# EAGLE design PFC_v1 (EAGLE 7.6.0)
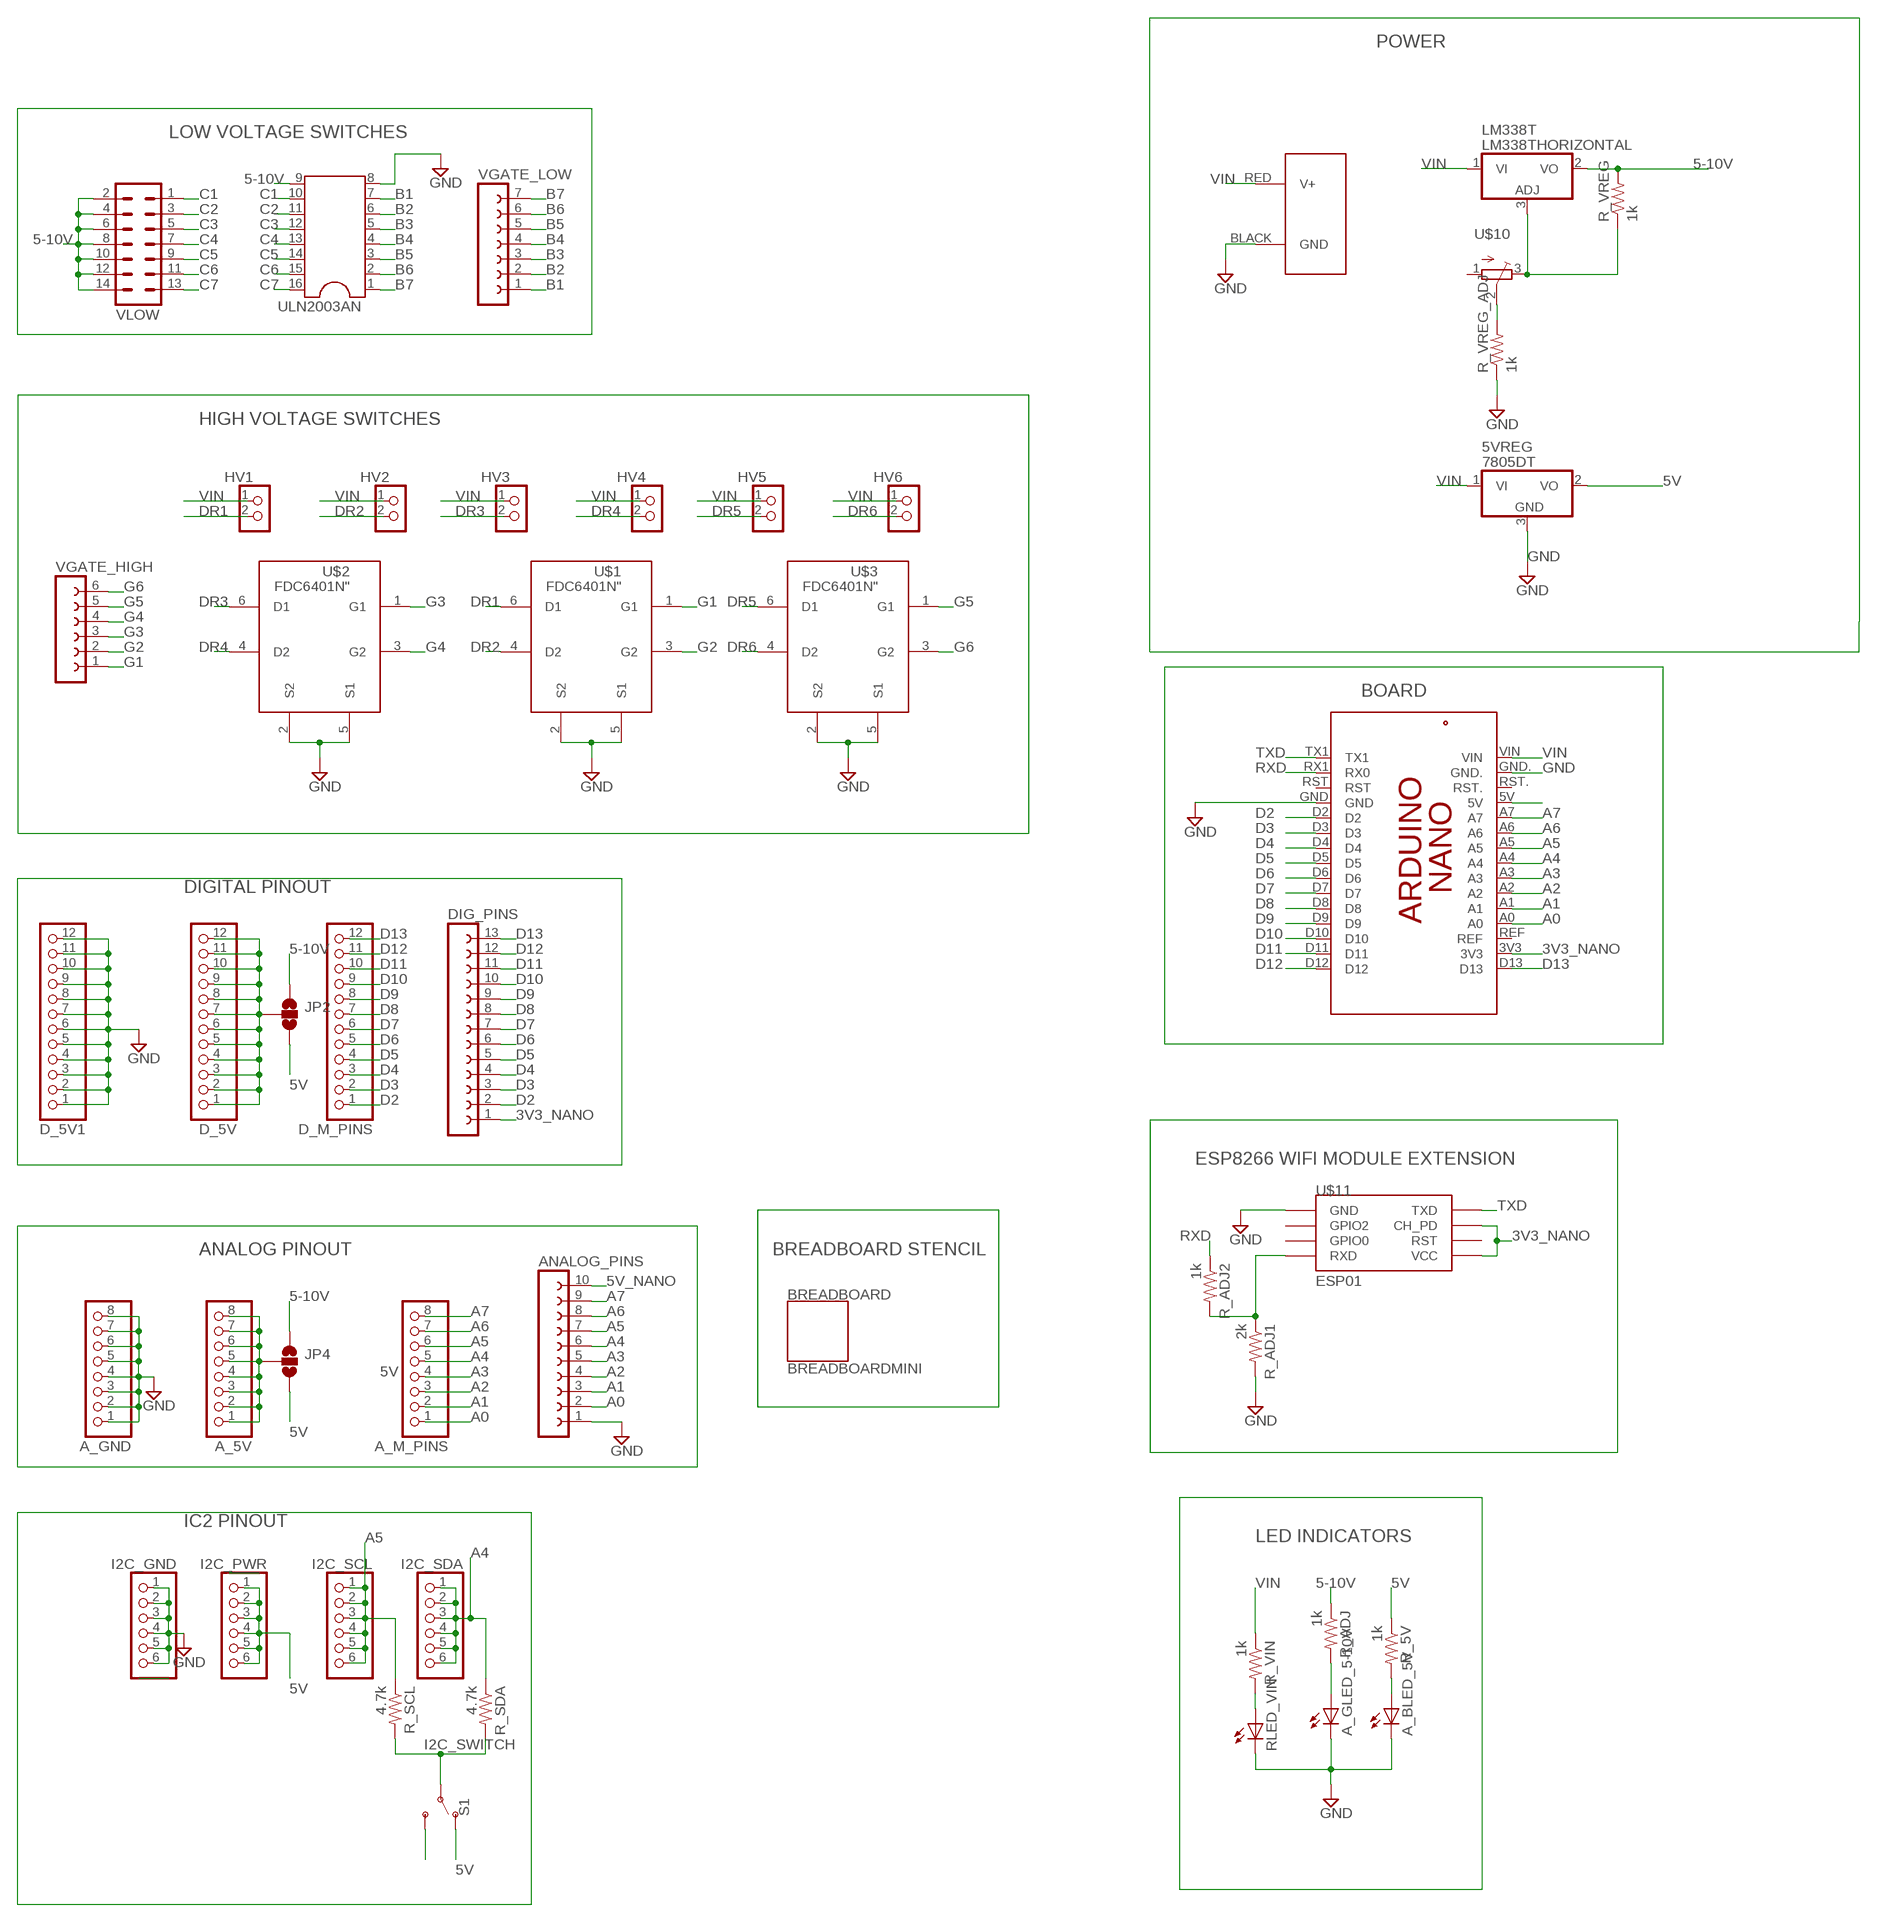
[diagram p0: schematic, sheet 1]

## Parts
5VREG  7805DT  [TO252]
A_5V  PINHD-1X8CLEANBIG  [1X08-CLEANBIG]
A_BLED_5V  LEDCHIP-LED0603  [CHIP-LED0603]
A_GLED_5-10V  LEDCHIP-LED0603  [CHIP-LED0603]
A_GND  PINHD-1X8CLEANBIG  [1X08-CLEANBIG]
A_M_PINS  PINHD-1X8CLEANBIG  [1X08-CLEANBIG]
ANALOG_PINS  FE10-1  [FE10]
BREADBOARD  BREADBOARDMINI  [BREADBOARD-MINI]
D_5V  PINHD-1X12-CB  [1X12-CB]
D_5V1  PINHD-1X12-CB  [1X12-CB]
D_M_PINS  PINHD-1X12-CB  [1X12-CB]
DIG_PINS  FE13-1  [FE13]
HV1  PINHD-2X1  [2X01]
HV2  PINHD-2X1  [2X01]
HV3  PINHD-2X1  [2X01]
HV4  PINHD-2X1  [2X01]
HV5  PINHD-2X1  [2X01]
HV6  PINHD-2X1  [2X01]
I2C_GND  PINHD-1X6CLEAN  [1X06-CLEAN]
I2C_PWR  PINHD-1X6CLEAN  [1X06-CLEAN]
I2C_SCL  PINHD-1X6CLEAN  [1X06-CLEAN]
I2C_SDA  PINHD-1X6CLEAN  [1X06-CLEAN]
J1  POWERPOLE_POWER25A_HORIZONTAL_G2  [POWERPOLE_PAIR_25A_HORIZ_G2]
JP2  SOLDERJUMPER_2WAYT  [SJ_2]
JP4  SOLDERJUMPER_2WAYT  [SJ_2]
LM338T  LM338THORIZONTAL  [TO220H]
PCB1  ARDUINO_NANO_SHIELD  [ARDUINO_NANO_SHIELD]
R_5V  1k  R-US_R0603  [R0603]
R_ADJ  1k  R-US_R0603  [R0603]
R_ADJ1  2k  R-US_R0603  [R0603]
R_ADJ2  1k  R-US_R0603  [R0603]
R_SCL  4.7k  R-US_R0603  [R0603]
R_SDA  4.7k  R-US_R0603  [R0603]
R_VIN  1k  R-US_R0603  [R0603]
R_VREG  1k  R-US_R0603  [R0603]
R_VREG_ADJ  1k  R-US_R0603  [R0603]
RLED_VIN  LEDCHIP-LED0603  [CHIP-LED0603]
S1  SWITCH-SPDT-PTH-11.6X4.0MM  [SWITCH_SPDT_PTH_11.6X4.0MM]
U$1  FDC6401N"  [SSOT-6]
U$2  FDC6401N"  [SSOT-6]
U$3  FDC6401N"  [SSOT-6]
U$10  TRIMPOTTC33X  [TC33X]
U$11  ESP01  [ESP01]
ULN2003AN  DIL16S  [SOCKET-16]
VGATE_HIGH  FE06-1  [FE06]
VGATE_LOW  FE07-1  [FE07]
VLOW  MA07-2  [MA07-2]

## Nets
3V3_NANO: DIG_PINS.1 PCB1.3V3 U$11.CH_PD U$11.VCC
5-10V: JP2.1 JP4.1 LM338T.2(VO) R_ADJ.1 R_VREG.2 ULN2003AN.9 VLOW.2 VLOW.4 VLOW.6 VLOW.8 VLOW.10 VLOW.12 VLOW.14
5V: 5VREG.2(VO) I2C_PWR.1 I2C_PWR.2 I2C_PWR.3 I2C_PWR.4 I2C_PWR.5 I2C_PWR.6 JP2.3 JP4.3 R_5V.1 S1.1(O)
5V_NANO: ANALOG_PINS.10 PCB1.5V
A0: A_M_PINS.1 ANALOG_PINS.2 PCB1.A0
A1: A_M_PINS.2 ANALOG_PINS.3 PCB1.A1
A2: A_M_PINS.3 ANALOG_PINS.4 PCB1.A2
A3: A_M_PINS.4 ANALOG_PINS.5 PCB1.A3
A4: A_M_PINS.5 ANALOG_PINS.6 I2C_SDA.1 I2C_SDA.2 I2C_SDA.3 I2C_SDA.4 I2C_SDA.5 I2C_SDA.6 PCB1.A4 R_SDA.1
A5: A_M_PINS.6 ANALOG_PINS.7 I2C_SCL.1 I2C_SCL.2 I2C_SCL.3 I2C_SCL.4 I2C_SCL.5 I2C_SCL.6 PCB1.A5 R_SCL.1
A6: A_M_PINS.7 ANALOG_PINS.8 PCB1.A6
A7: A_M_PINS.8 ANALOG_PINS.9 PCB1.A7
B1: ULN2003AN.7 VGATE_LOW.1
B2: ULN2003AN.6 VGATE_LOW.2
B3: ULN2003AN.5 VGATE_LOW.3
B4: ULN2003AN.4 VGATE_LOW.4
B5: ULN2003AN.3 VGATE_LOW.5
B6: ULN2003AN.2 VGATE_LOW.6
B7: ULN2003AN.1 VGATE_LOW.7
C1: ULN2003AN.10 VLOW.1
C2: ULN2003AN.11 VLOW.3
C3: ULN2003AN.12 VLOW.5
C4: ULN2003AN.13 VLOW.7
C5: ULN2003AN.14 VLOW.9
C6: ULN2003AN.15 VLOW.11
C7: ULN2003AN.16 VLOW.13
D2: D_M_PINS.1 DIG_PINS.2 PCB1.D2
D3: D_M_PINS.2 DIG_PINS.3 PCB1.D3
D4: D_M_PINS.3 DIG_PINS.4 PCB1.D4
D5: D_M_PINS.4 DIG_PINS.5 PCB1.D5
D6: D_M_PINS.5 DIG_PINS.6 PCB1.D6
D7: D_M_PINS.6 DIG_PINS.7 PCB1.D7
D8: D_M_PINS.7 DIG_PINS.8 PCB1.D8
D9: D_M_PINS.8 DIG_PINS.9 PCB1.D9
D10: D_M_PINS.9 DIG_PINS.10 PCB1.D10
D11: D_M_PINS.10 DIG_PINS.11 PCB1.D11
D12: D_M_PINS.11 DIG_PINS.12 PCB1.D12
D13: D_M_PINS.12 DIG_PINS.13 PCB1.D13
DR1: HV1.2 U$1.6(D1)
DR2: HV2.2 U$1.4(D2)
DR3: HV3.2 U$2.6(D1)
DR4: HV4.2 U$2.4(D2)
DR5: HV5.2 U$3.6(D1)
DR6: HV6.2 U$3.4(D2)
G1: U$1.1(G1) VGATE_HIGH.1
G2: U$1.3(G2) VGATE_HIGH.2
G3: U$2.1(G1) VGATE_HIGH.3
G4: U$2.3(G2) VGATE_HIGH.4
G5: U$3.1(G1) VGATE_HIGH.5
G6: U$3.3(G2) VGATE_HIGH.6
GND: 5VREG.3(GND) A_BLED_5V.C A_GLED_5-10V.C A_GND.1 A_GND.2 A_GND.3 A_GND.4 A_GND.5 A_GND.6 A_GND.7 A_GND.8 ANALOG_PINS.1 D_5V1.1 D_5V1.2 D_5V1.3 D_5V1.4 D_5V1.5 D_5V1.6 D_5V1.7 D_5V1.8 D_5V1.9 D_5V1.10 D_5V1.11 D_5V1.12 I2C_GND.1 I2C_GND.2 I2C_GND.3 I2C_GND.4 I2C_GND.5 I2C_GND.6 J1.BLACK(GND) PCB1.GND PCB1.GND. R_ADJ1.2 R_VREG_ADJ.1 RLED_VIN.C U$1.2(S2) U$1.5(S1) U$2.2(S2) U$2.5(S1) U$3.2(S2) U$3.5(S1) U$11.GND ULN2003AN.8
I2C_SWITCH: R_SCL.2 R_SDA.2 S1.2(P)
N$1: R_VIN.2 RLED_VIN.A
N$2: R_VREG_ADJ.2 U$10.2(S)
N$3: A_GLED_5-10V.A R_ADJ.2
N$4: A_BLED_5V.A R_5V.2
N$5: LM338T.3(GND) R_VREG.1 U$10.3(E)
N$6: D_5V.1 D_5V.2 D_5V.3 D_5V.4 D_5V.5 D_5V.6 D_5V.7 D_5V.8 D_5V.9 D_5V.10 D_5V.11 D_5V.12 JP2.2
N$8: A_5V.1 A_5V.2 A_5V.3 A_5V.4 A_5V.5 A_5V.6 A_5V.7 A_5V.8 JP4.2
N$15: S1.3(S)
RXD: PCB1.RX1(RX0) R_ADJ1.1 R_ADJ2.1 R_ADJ2.2 U$11.RX(RXD)
TXD: PCB1.TX1 U$11.TX(TXD)
VIN: 5VREG.1(VI) HV1.1 HV2.1 HV3.1 HV4.1 HV5.1 HV6.1 J1.RED(V+) LM338T.1(VI) PCB1.VIN R_VIN.1
Unconnected: PCB1.REF PCB1.RST PCB1.RST. U$10.1(A) U$11.GPIO0 U$11.GPIO2 U$11.RST

## Notes on the sheet
- POWER
- LOW VOLTAGE SWITCHES
- HIGH VOLTAGE SWITCHES
- BOARD
- DIGITAL PINOUT
- ESP8266 WIFI MODULE EXTENSION
- ANALOG PINOUT | BREADBOARD STENCIL
- IC2 PINOUT
- LED INDICATORS

## Library data of the parts
5VREG = adafruit:78*: Positive VOLTAGE REGULATOR Added bigger pads to the TO-92 package
A_5V A_GND A_M_PINS = adafruit:PINHD-1X8: PIN HEADER
A_BLED_5V A_GLED_5-10V RLED_VIN = led:LED: LED OSRAM: - CHIPLED LG R971, LG N971, LY N971, LG Q971, LY Q971, LO R971, LY R971 LH N974, LH R974 LS Q976, LO Q976, LY Q976 LO Q996 - Hyper CHIPLED LW Q18S LB Q993, LB Q99A, LB R99A - SideLED LS A670, LO A670, LY A670, LG A670, LP A670 LB A673, LV A673, LT A673, LW A673 LH A674 LY A675 LS A676, LA A676, LO A676, LY A676, LW A676 LS A679, LY A679, LG A679 - Hyper Micro SIDELED® LS Y876, LA Y876, LO Y876, LY Y876 LT Y87S - SmartLED LW L88C, LW L88S LB L89C, LB L89S, LG L890 LS L89K, LO L89K, LY L89K LS L896, LA L896, LO L896, LY L896 - TOPLED LS T670, LO T670, LY T670, LG T670, LP T670 LSG T670, LSP T670, LSY T670, LOP T670, LYG T670 LG T671, LOG T671, LSG T671 LB T673, LV T673, LT T673, LW T673 LH T674 LS T676, LA T676, LO T676, LY T676, LB T676, LH T676, LSB T676, LW T676 LB T67C, LV T67C, LT T67C, LS T67K, LO T67K, LY T67K, LW E67C LS E67B, LA E67B, LO E67B, LY E67B, LB E67C, LV E67C, LT E67C LW T67C LS T679, LY T679, LG T679 LS T770, LO T770, LY T770, LG T770, LP T770 LB T773, LV T773, LT T773, LW T773 LH T774 LS E675, LA E675, LY E675, LS T675 LS T776, LA T776, LO T776, LY T776, LB T776 LHGB T686 LT T68C, LB T68C - Hyper Mini TOPLED® LB M676 - Mini TOPLED Santana® LG M470 LS M47K, LO M47K, LY M47K Source: http://www.osram.convergy.de LUXEON: - LUMILED® LXK2-PW12-R00, LXK2-PW12-S00, LXK2-PW14-U00, LXK2-PW14-V00 LXK2-PM12-R00, LXK2-PM12-S00, LXK2-PM14-U00 LXK2-PE12-Q00, LXK2-PE12-R00, LXK2-PE12-S00, LXK2-PE14-T00, LXK2-PE14-U00 LXK2-PB12-K00, LXK2-PB12-L00, LXK2-PB12-M00, LXK2-PB14-N00, LXK2-PB14-P00, LXK2-PB14-Q00 LXK2-PR12-L00, LXK2-PR12-M00, LXK2-PR14-Q00, LXK2-PR14-R00 LXK2-PD12-Q00, LXK2-PD12-R00, LXK2-PD12-S00 LXK2-PH12-R00, LXK2-PH12-S00 LXK2-PL12-P00, LXK2-PL12-Q00, LXK2-PL12-R00 Source: www.luxeon.com KINGBRIGHT: KA-3528ASYC Source: www.kingbright.com
ANALOG_PINS = con-lsta:FE10-1: FEMALE HEADER; OC_FARNELL: unknown; OC_NEWARK: unknown
BREADBOARD = SparkFun-Boards:BREADBOARD: SparkFun Breadboard Mini This is the mechnical outline for the very small self adhesive breadboard from SparkFun Electronics and our prototyping breadboard of the same size. Good for very small proto areas. SparkFun Products: White <https://www.sparkfun.com/products/7916> Green <https://www.sparkfun.com/products/12046> Black <https://www.sparkfun.com/products/12047> Red <https://www.sparkfun.com/products/12044> Blue <https://www.sparkfun.com/products/12045> SparkFun Solder-able Breadboard-Mini <https://www.sparkfun.com/products/12702>; PROD_ID: COMP-12034
D_5V D_5V1 D_M_PINS = adafruit:PINHD-1X12: PIN HEADER
DIG_PINS = con-lsta:FE13-1: FEMALE HEADER; OC_FARNELL: unknown; OC_NEWARK: unknown
HV1-HV6 = pinhead:PINHD-2X1
I2C_GND I2C_PWR I2C_SCL I2C_SDA = adafruit:PINHD-1X6: PIN HEADER
J1 = powerpoles:POWERPOLE_POWER: Anderson Powerpole Power Connector using ameteur radio standard layout
JP2 JP4 = SparkFun-Passives:SOLDERJUMPER_2WAY: Solder Jumper 2 way solder jumper
LM338T = Texas Instruments_By_element14_Batch_1:LM338T
PCB1 = E14_Arduino_revC:ARDUINO_NANO_SHIELD: Arduino Nano pinout for making a shield
R_5V R_ADJ R_ADJ1 R_ADJ2 R_SCL R_SDA R_VIN R_VREG R_VREG_ADJ = resistor:R-US_: RESISTOR, American symbol
S1 = SparkFun-Switches:SWITCH-SPDT: Single Pole, Double Throw (SPDT) Switch Single-pole, double-throw (SPDT) switch. Variant Overview SMD-AYZ0202 Surface Mount DPDT Switch <https://www.sparkfun.com/products/597> (COM-00597) Used on e.g. LilyPad Arduino USB - ATmega32U4 Board <https://www.sparkfun.com/products/12049> PTH-11.6X4.0MM SPDT Mini Power Switch <https://www.sparkfun.com/products/102> (COM-00102) Used on e.g. SparkFun Simon Says - Through-Hole Soldering Kit <https://www.sparkfun.com/products/10547> (KIT-10547) PTH-11.6X4.0MM-KIT KIT version of SPDT Mini Power Switch - Simplifies soldering by removing tStop of switch pins - only one side can be soldered. PTH-11.6X4.0MM-LOCK LOCK version of SPDT Mini Power Switch - Offset pins hold switch in place for easier soldering. SMD-RIGHT-ANGLE Surface Mount Right Angle Switch <https://www.sparkfun.com/products/10860> (COM-10860) Used on e.g. SparkFun ESP8266 Thing <https://www.sparkfun.com/products/13231>; PROD_ID: SWCH-08261; SF_SKU: COM-00102
U$1-U$3 = fairchild:FDC6401N: Dual N Channel MOSFET
U$10 = adafruit:TRIMPOT: SMT trimmer potentiometer part number TC33X http://www.ladyada.net/library/eagle
U$11 = esp8266modules:ESP01: ESP8266 Wifi module 01
ULN2003AN = ic-package:DIL16: Dual In Line / Socket
VGATE_HIGH = con-lsta:FE06-1: FEMALE HEADER; OC_FARNELL: unknown; OC_NEWARK: unknown
VGATE_LOW = con-lsta:FE07-1: FEMALE HEADER; OC_FARNELL: unknown; OC_NEWARK: unknown
VLOW = con-lstb:MA07-2: PIN HEADER; OC_FARNELL: unknown; OC_NEWARK: unknown

## Board
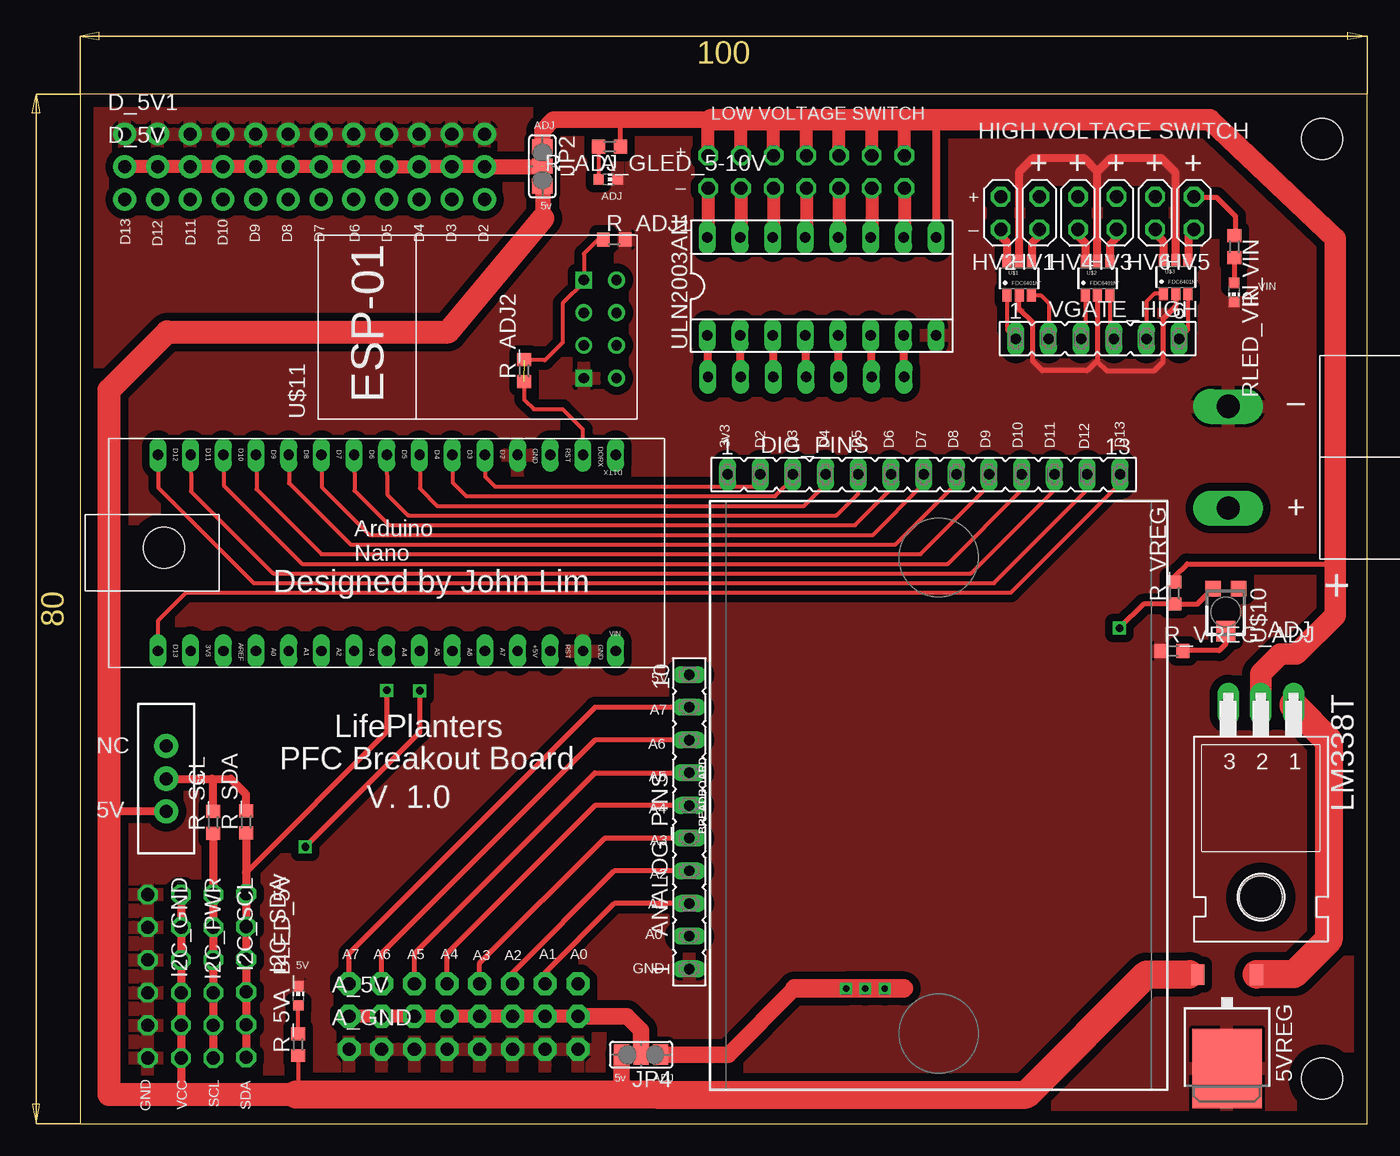
[diagram p1: board, top side]
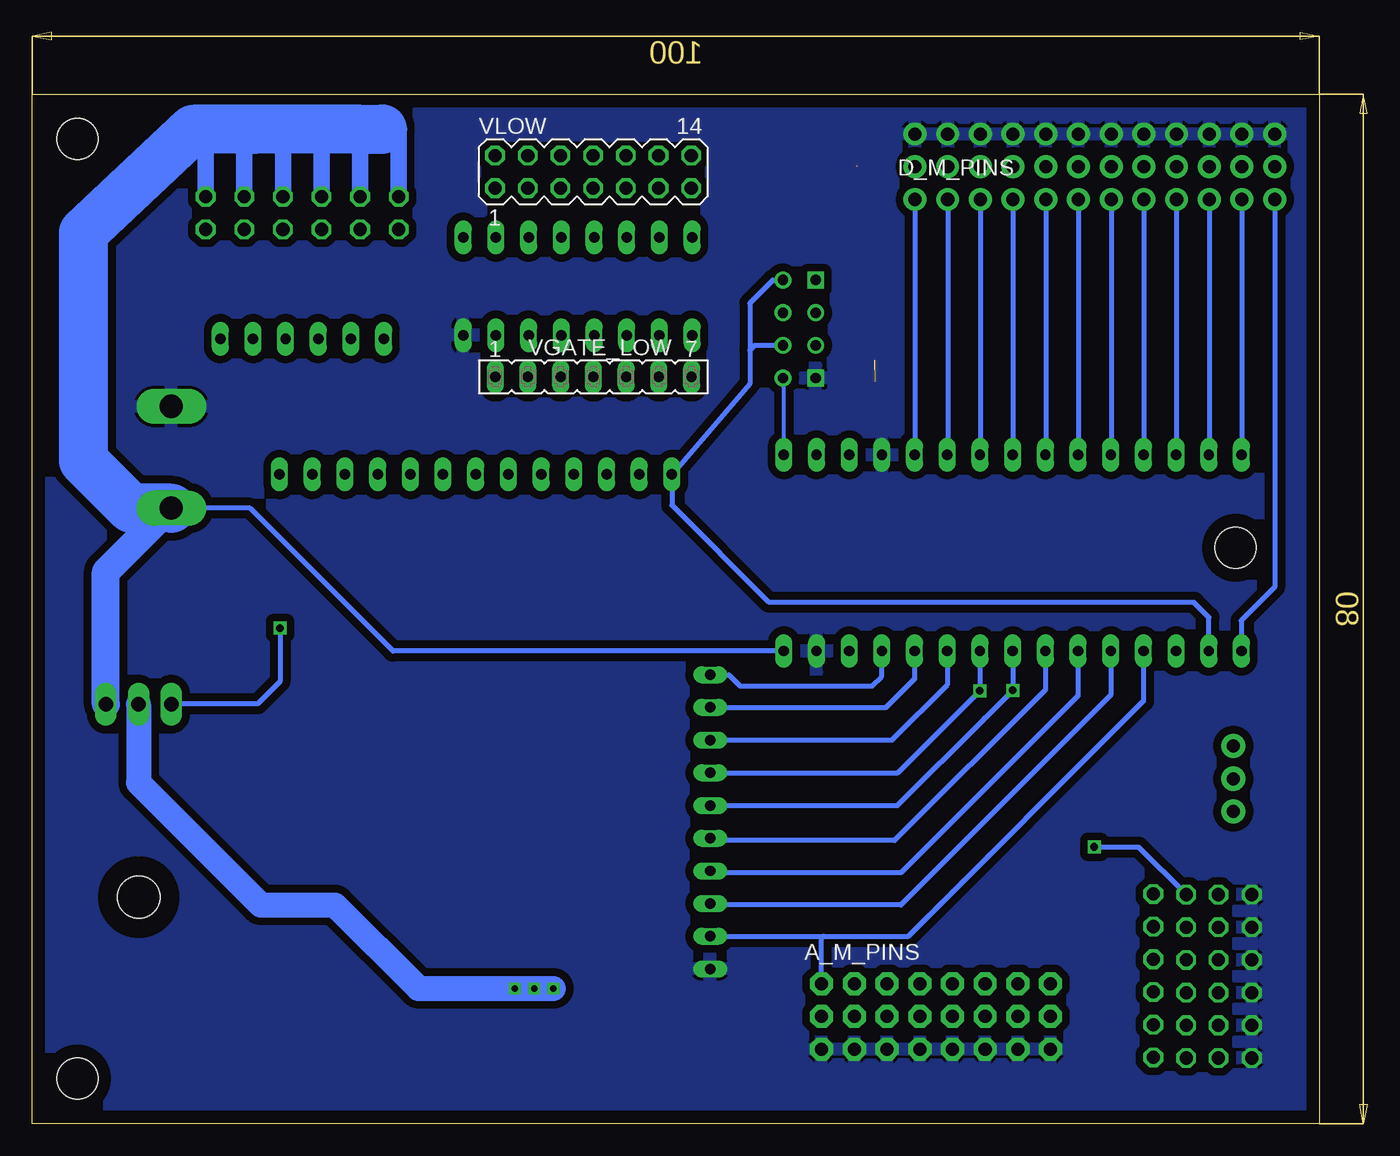
[diagram p2: board, bottom side, seen from below]

Size 100 x 80 mm. Coordinates in mm from the lower left corner, seen from the top.
Outline: 0,0 100,0 100,80 0,80 0,0
Copper layers (1*16): Top 0.035mm / dielectric 1.5mm / Bottom 0.035mm
Design rules "default": minimum track width 10mil, minimum drill 24mil, track to track 8mil, track to pad 8mil, pad to pad 8mil, via to via 8mil, smd to smd 8mil, copper to edge 40mil, drill to drill 8mil, minimum pad ring 10mil, minimum via ring 8mil, stop-mask expansion 4mil, vias tented up to drill 0mil, thermal gap 10mil
Holes 3.2 mm at 6.5,44.75 96.5,76.5 96.5,3.5

### Footprints (pad centres in the part's own frame; a part is rotated, then mirrored left to right if it is on the bottom)
TO252 = smd 1 x 1.6: 1 -2.28,-4.8; 2 2.28,-4.8 | smd 5.4 x 6.2: 3 0,2.5
1X08-CLEANBIG = drill 1.016 pad 1.778 octagon: 1 -8.89,0; 2 -6.35,0; 3 -3.81,0; 4 -1.27,0; 5 1.27,0; 6 3.81,0; 7 6.35,0; 8 8.89,0
CHIP-LED0603 = smd 0.8 x 0.8: A 0,-0.75; C 0,0.75
FE10 = drill 0.813 long: 1 -11.43,0; 2 -8.89,0; 3 -6.35,0; 4 -3.81,0; 5 -1.27,0; 6 1.27,0; 7 3.81,0; 8 6.35,0; 9 8.89,0; 10 11.43,0
1X12-CB = drill 1.016 pad 1.778: 1 -13.97,0; 2 -11.43,0; 3 -8.89,0; 4 -6.35,0; 5 -3.81,0; 6 -1.27,0; 7 1.27,0; 8 3.81,0; 9 6.35,0; 10 8.89,0; 11 11.43,0; 12 13.97,0
FE13 = drill 0.813 long: 1 -15.24,0; 2 -12.7,0; 3 -10.16,0; 4 -7.62,0; 5 -5.08,0; 6 -2.54,0; 7 0,0; 8 2.54,0; 9 5.08,0; 10 7.62,0; 11 10.16,0; 12 12.7,0; 13 15.24,0
2X01 = drill 1.016 octagon: 1 -1.27,-1.27; 2 -1.27,1.27
1X06-CLEAN = drill 1.016 octagon: 1 -6.35,0; 2 -3.81,0; 3 -1.27,0; 4 1.27,0; 5 3.81,0; 6 6.35,0
POWERPOLE_PAIR_25A_HORIZ_G2 = drill 1.8 long: BLACK -3.95,-7.1; RED 3.95,-7.1
SJ_2 = smd 1.168 x 1.6: 1 -1.524,0; 2 0,0; 3 1.524,0
TO220H = drill 1.118 long: 1 -2.54,-7.62; 2 0,-7.62; 3 2.54,-7.62 | hole 3.302: 0,7.366
ARDUINO_NANO_SHIELD = drill 0.8 long: 3V3 -13.97,-7.62; 5V 11.43,-7.62; A0 -8.89,-7.62; A1 -6.35,-7.62; A2 -3.81,-7.62; A3 -1.27,-7.62; A4 1.27,-7.62; A5 3.81,-7.62; A6 6.35,-7.62; A7 8.89,-7.62; D2 8.89,7.62; D3 6.35,7.62; D4 3.81,7.62; D5 1.27,7.62; D6 -1.27,7.62; D7 -3.81,7.62; D8 -6.35,7.62; D9 -8.89,7.62; D10 -11.43,7.62; D11 -13.97,7.62; D12 -16.51,7.62; D13 -16.51,-7.62; GND 11.43,7.62; GND. 16.51,-7.62; REF -11.43,-7.62; RST 13.97,7.62; RST. 13.97,-7.62; RX1 16.51,7.62; TX1 19.05,7.62; VIN 19.05,-7.62
R0603 = smd 1 x 1.1: 1 -0.85,0; 2 0.85,0
SWITCH_SPDT_PTH_11.6X4.0MM = drill 1.016 pad 1.88: 1 0,2.54; 2 0,0; 3 0,-2.54
SSOT-6 = smd 0.7 x 1: 1 -0.95,-1.3; 2 0,-1.3; 3 0.95,-1.3; 4 -0.95,1.3; 5 0,1.3; 6 0.95,1.3
TC33X = smd 1.2 x 1.2: 1 -1,-1.825; 3 1,-1.825 | smd 1.5 x 1.6: 2 0,1.5
ESP01 = drill 0.8: CH_PD -1.285,-8.178; GPIO0 1.255,-5.638; GPIO2 -1.285,-5.638; RST 1.255,-8.178; TX -3.825,-8.178; VCC 3.795,-8.178 | drill 0.8 square: GND -3.825,-5.638; RX 3.795,-5.638
SOCKET-16 = drill 0.813 long: 1 -8.89,-3.81; 2 -6.35,-3.81; 3 -3.81,-3.81; 4 -1.27,-3.81; 5 1.27,-3.81; 6 3.81,-3.81; 7 6.35,-3.81; 8 8.89,-3.81; 9 8.89,3.81; 10 6.35,3.81; 11 3.81,3.81; 12 1.27,3.81; 13 -1.27,3.81; 14 -3.81,3.81; 15 -6.35,3.81; 16 -8.89,3.81
FE06 = drill 0.813 long: 1 -6.35,0; 2 -3.81,0; 3 -1.27,0; 4 1.27,0; 5 3.81,0; 6 6.35,0
FE07 = drill 0.813 long: 1 -7.62,0; 2 -5.08,0; 3 -2.54,0; 4 0,0; 5 2.54,0; 6 5.08,0; 7 7.62,0
MA07-2 = drill 1.016 octagon: 1 -7.62,-1.27; 2 -7.62,1.27; 3 -5.08,-1.27; 4 -5.08,1.27; 5 -2.54,-1.27; 6 -2.54,1.27; 7 0,-1.27; 8 0,1.27; 9 2.54,-1.27; 10 2.54,1.27; 11 5.08,-1.27; 12 5.08,1.27; 13 7.62,-1.27; 14 7.62,1.27

### Placement (x,y rotation side)
5VREG  89.1,6.79 180 top
A_5V  29.78,8.33 0 top
A_BLED_5V  16.95,9.95 0 top
A_GLED_5-10V  41.03,73.36 270 top
A_GND  29.78,5.79 0 top
A_M_PINS  29.78,10.87 0 bottom
ANALOG_PINS  47.33,23.45 90 top
BREADBOARD  66.7,25.5 90 top
D_5V  17.45,74.35 0 top
D_5V1  17.45,76.89 0 top
D_M_PINS  17.45,71.81 0 bottom
DIG_PINS  65.54,50.44 0 top
HV1  73.25,70.75 180 top
HV2  70.25,70.75 180 top
HV3  79.25,70.75 180 top
HV4  76.25,70.75 180 top
HV5  85.25,70.75 180 top
HV6  82.25,70.75 180 top
I2C_GND  5.25,11.45 270 top
I2C_PWR  7.85,11.45 270 top
I2C_SCL  10.35,11.45 270 top
I2C_SDA  12.9,11.5 270 top
J1  96.29,51.78 270 top
JP2  35.91,74.38 270 top
JP4  43.58,5.36 180 top
LM338T  91.73,24.97 180 top
PCB1  22.56,44.34 0 top
R_5V  16.93,6.14 90 top
R_ADJ  41.14,75.9 180 top
R_ADJ1  41.5,68.68 0 top
R_ADJ2  34.5,58.5 90 top
R_SCL  10.35,23.4 90 top
R_SDA  12.9,23.45 90 top
R_VIN  89.67,68.13 270 top
R_VREG  85.01,41.22 90 top
R_VREG_ADJ  84.82,36.72 0 top
RLED_VIN  89.64,64.58 180 top
S1  6.7,26.8 180 top
U$1  72.96,65.67 0 top
U$2  79.04,65.67 0 top
U$3  85.12,65.77 0 top
U$10  89,39.75 180 top
U$11  33.5,61.75 90 top
ULN2003AN  57.62,65.06 0 top
VGATE_HIGH  79.04,60.99 0 top
VGATE_LOW  56.4,58.02 0 bottom
VLOW  56.42,73.95 0 bottom

### Tracks (layer width: path | path; a pad name or v marks a point on that pad's centre or on a via)
3V3_NANO
  Bottom 0.406: PCB1.3V3 8.59,39.34 9.75,40.5 42.75,40.5 50.3,48.05 DIG_PINS.1 44.25,57.49 44.25,60.1 | 44.25,60.1 44.25,63.75 42.45,65.55 U$11.VCC | U$11.CH_PD 43.88,60.47 44.25,60.1
5-10V  (via drill 0.5 pad 0.81)
  Top 0.406: 97.17,42.83 97.5,42.5 | 97.43,43.57 97.5,43.5 | R_ADJ.1 41.99,77.99 42,78 | R_VREG.2 85.01,42.51 86,43.5 97,43.5 97.5,43
  Top 0.61: 48.6,78 48.8,77.8 | ULN2003AN.9 66.51,77.51 67,78
  Top 1.016: VLOW.14 48.8,77.8 49,78 | VLOW.12 51.34,77.91 51.25,78 | VLOW.10 53.88,77.63 54.25,78 | VLOW.8 56.42,77.92 56.5,78 | VLOW.6 58.96,77.79 58.75,78 | VLOW.4 61.5,77.75 61.75,78 | VLOW.2 64.04,77.96 64,78
  Top 1.27: JP2.1 35.91,77.16 36.75,78 42,78 48.6,78 | 55.5,10.5 50.36,5.36 JP4.1
  Top 1.422: 64,10.5 v62.5,10.5 v61,10.5 v59.5,10.5 55.5,10.5
  Top 1.676: 49,78 51.25,78 54.25,78 56.5,78 58.75,78 61.75,78 64,78 67,78 87.75,78 97.5,68.75 97.5,43.5 97.5,43 97.5,42.5 97.5,39.5 94.5,36.5 93.25,36.5 91.73,34.98 LM338T.2
  Bottom 1.93: v59.5,10.5 v61,10.5 v62.5,10.5 70,10.5 76.5,17 82.25,17 91.73,26.48 LM338T.2
5V
  Top 0.305: R_5V.1 16.93,2.43 16.75,2.25
  Top 0.61: I2C_PWR.1 I2C_PWR.2 I2C_PWR.3 I2C_PWR.4 I2C_PWR.5 I2C_PWR.6 7.85,2.35 7.75,2.25 | S1.1 2.51,24.26 2.25,24
  Top 0.813: 86.19,11.61 86.8,11.61 5VREG.2
  Top 1.016: 35.95,72.82 JP2.3 | 43.58,2.68 44,2.26
  Top 1.2: 35.95,70.35 35.95,72.82
  Top 1.27: 44.33,2.68 44.75,2.26 | 43.08,2.34 43,2.26 | JP4.3 42.06,2.32 42,2.26
  Top 1.778: 16.75,2.25 7.75,2.25 2.25,2.25 2.25,24 2.25,57 6.75,61.5 28.6,61.5 35.95,70.35
  Top 1.93: 16.76,2.26 16.75,2.25
  Top 2.184: 16.76,2.26 42,2.26 43,2.26 44,2.26 44.75,2.26 73.51,2.26 82.84,11.59 86.17,11.59 86.19,11.61
5V_NANO
  Bottom 0.406: ANALOG_PINS.10 45.88,34.88 45,34 34.75,34 34,34.75 PCB1.5V
A0
  Bottom 0.406: ANALOG_PINS.2 38.5,14.56 | 38.5,14.56 31.94,14.56 13.67,32.83 PCB1.A0 | A_M_PINS.1 38.67,14.39 38.5,14.56
A1
  Top 0.406: A_M_PINS.2 36.13,11.73 41.5,17.1 ANALOG_PINS.3
  Bottom 0.406: PCB1.A1 16.21,33.29 32.5,17 47.23,17 ANALOG_PINS.3
A2
  Top 0.406: A_M_PINS.3 33.59,11.73 41.5,19.64 ANALOG_PINS.4
  Bottom 0.406: PCB1.A2 18.75,33.25 32.5,19.5 47.19,19.5 ANALOG_PINS.4
A3
  Top 0.406: A_M_PINS.4 31.05,12.48 40.75,22.18 ANALOG_PINS.5
  Bottom 0.406: PCB1.A3 21.29,33.71 33,22 47.15,22 ANALOG_PINS.5
A4  (via drill 0.6)
  Top 0.406: A_M_PINS.5 28.51,13.23 40,24.72 ANALOG_PINS.6 | v23.83,33.67 23.83,30.43 12.9,19.5
  Top 0.61: I2C_SDA.6 I2C_SDA.5 I2C_SDA.4 I2C_SDA.3 I2C_SDA.2 I2C_SDA.1 12.9,19.5 R_SDA.1
  Bottom 0.406: PCB1.A4 v23.83,33.67 26,31.5 | 26,31.5 26.03,31.5 | ANALOG_PINS.6 32.78,24.72 26,31.5
A5  (via drill 0.6)
  Top 0.406: v26.39,33.63 26.39,30.39 v17.5,21.5 | A_M_PINS.6 25.97,13.23 40,27.26 ANALOG_PINS.7
  Top 0.61: I2C_SCL.6 I2C_SCL.5 I2C_SCL.4 I2C_SCL.3 I2C_SCL.2 I2C_SCL.1 R_SCL.1
  Bottom 0.406: PCB1.A5 26.37,33.4 v26.39,33.63 26.39,33.61 32.74,27.26 ANALOG_PINS.7 | v17.5,21.5 14.05,21.5 I2C_SCL.1
A6
  Top 0.406: A_M_PINS.7 23.43,13.23 40,29.8 ANALOG_PINS.8
  Bottom 0.406: PCB1.A6 28.91,34.09 33.2,29.8 ANALOG_PINS.8
A7
  Top 0.406: A_M_PINS.8 20.89,13.23 40,32.34 ANALOG_PINS.9
  Bottom 0.406: PCB1.A7 31.45,34.55 33.66,32.34 ANALOG_PINS.9
B1
  Top 0.61: ULN2003AN.7 63.97,58.07 VGATE_LOW.1
B2
  Top 0.61: ULN2003AN.6 61.43,58.07 VGATE_LOW.2
B3
  Top 0.61: ULN2003AN.5 58.89,58.07 VGATE_LOW.3
B4
  Top 0.61: ULN2003AN.4 56.35,58.07 VGATE_LOW.4
B5
  Top 0.61: ULN2003AN.3 53.81,58.07 VGATE_LOW.5
B6
  Top 0.61: ULN2003AN.2 51.27,58.07 VGATE_LOW.6
B7
  Top 0.61: ULN2003AN.1 48.73,58.07 VGATE_LOW.7
C1
  Top 1.016: VLOW.1 64.04,68.94 ULN2003AN.10
C2
  Top 1.016: VLOW.3 61.5,68.94 ULN2003AN.11
C3
  Top 1.016: VLOW.5 58.96,68.94 ULN2003AN.12
C4
  Top 1.016: VLOW.7 56.42,68.94 ULN2003AN.13
C5
  Top 1.016: VLOW.9 53.88,68.94 ULN2003AN.14
C6
  Top 1.016: VLOW.11 51.34,68.94 ULN2003AN.15
C7
  Top 1.016: VLOW.13 48.8,68.94 ULN2003AN.16
D2
  Top 0.305: PCB1.D2 31.48,50.27 32.25,49.5 52.5,49.5 52.84,49.84 DIG_PINS.2
  Bottom 0.406: D_M_PINS.1 31.42,51.11 PCB1.D2
D3
  Top 0.305: PCB1.D3 28.94,49.81 30,48.75 54,48.75 55.38,50.13 DIG_PINS.3
  Bottom 0.406: D_M_PINS.2 28.88,51.11 PCB1.D3
D4
  Top 0.305: PCB1.D4 26.4,49.35 27.75,48 56.25,48 57.92,49.67 DIG_PINS.4
  Bottom 0.406: D_M_PINS.3 26.34,51.11 PCB1.D4
D5
  Top 0.305: PCB1.D5 23.86,48.89 25.5,47.25 58.75,47.25 60.45,48.95 60.45,51.43 DIG_PINS.5
  Bottom 0.406: D_M_PINS.4 23.8,51.11 PCB1.D5
D6
  Top 0.305: PCB1.D6 21.32,49.18 24,46.5 60.2,46.5 62.95,49.25 62.95,51.39 DIG_PINS.6
  Bottom 0.406: D_M_PINS.5 21.26,51.11 PCB1.D6
D7
  Top 0.305: PCB1.D7 18.78,49.47 22.5,45.75 61.6,45.75 65.45,49.6 65.45,51.35 DIG_PINS.7
  Bottom 0.406: D_M_PINS.6 18.72,51.11 PCB1.D7
D8
  Top 0.305: PCB1.D8 16.24,49.76 21,45 63.35,45 68.05,49.7 68.05,51.41 DIG_PINS.8
  Bottom 0.406: D_M_PINS.7 16.18,51.11 PCB1.D8
D9
  Top 0.305: PCB1.D9 13.7,49.3 18.75,44.25 65.3,44.25 70.65,49.6 70.65,51.41 DIG_PINS.9
  Bottom 0.406: D_M_PINS.8 13.64,51.11 PCB1.D9
D10
  Top 0.305: PCB1.D10 11.16,49.59 17.25,43.5 67.4,43.5 73.15,49.25 73.15,51.43 DIG_PINS.10
  Bottom 0.406: D_M_PINS.9 11.1,51.11 PCB1.D10
D11
  Top 0.305: PCB1.D11 8.62,49.13 15,42.75 69.2,42.75 75.75,49.3 75.75,51.39 DIG_PINS.11
  Bottom 0.406: D_M_PINS.10 8.56,51.11 PCB1.D11
D12
  Top 0.305: PCB1.D12 6.08,49.42 13.5,42 71,42 78.25,49.25 78.25,51.43 DIG_PINS.12
  Bottom 0.406: D_M_PINS.11 6.02,51.11 PCB1.D12
D13
  Top 0.305: PCB1.D13 6.08,39.08 8.25,41.25 72.3,41.25 80.75,49.7 80.75,51.41 DIG_PINS.13
  Bottom 0.406: D_M_PINS.12 3.48,41.68 6.08,39.08 PCB1.D13
DR1
  Top 0.61: HV1.2 74.52,68.97 73.95,68.4 73.95,67.01 U$1.6
DR2
  Top 0.61: HV2.2 71.52,69.02 71.5,69 72,68.5 U$1.4
DR3
  Top 0.61: HV3.2 80.52,68.82 80,68.3 U$2.6
DR4
  Top 0.61: HV4.2 77.52,68.98 78.1,68.4 U$2.4
DR5
  Top 0.61: HV5.2 86.52,69.32 86.1,68.9 86.1,67.1 U$3.6
DR6
  Top 0.61: HV6.2 83.52,69.18 84.15,68.55 84.15,67.09 U$3.4
G1
  Top 0.305: U$1.1 72.01,61.67 VGATE_HIGH.1
G2
  Top 0.305: U$1.3 74.63,64.37 75.25,63.75 75.25,61.01 VGATE_HIGH.2
G3
  Top 0.305: U$2.1 78.09,61.31 VGATE_HIGH.3
G4
  Top 0.305: U$2.3 79.99,61.31 VGATE_HIGH.4
G5
  Top 0.305: U$3.1 83.47,64.47 82.85,63.85 VGATE_HIGH.5
G6
  Top 0.305: U$3.3 86.07,61.67 VGATE_HIGH.6
GND
  Top 0.406: U$2.2 79.04,59.29 | 79.04,59.29 78.25,58.5 74.75,58.5 74,59.25 74,62.25 72.95,63.3 U$1.2 | U$3.2 85.12,63.52 84.15,62.55 84.15,59.2 83.45,58.5 79.75,58.5 79.04,59.21 79.04,59.29
  Top 0.61: U$1.5 72.96,73.96 74,75 78,75 79.04,73.96 | U$2.5 79.04,73.96 | U$3.5 85.12,73.88 84,75 80.08,75 79.04,73.96
  pour Top (isolate 0.61): 0.65,0.6 99.35,0.6 99.4,79.35 0.8,79.45
  pour Bottom (isolate 0.61): 0.75,78.75 0.75,0.75 99,0.75 99,6.75 99,78.75
I2C_SWITCH
  Top 0.61: S1.2 10.25,26.8 | 10.25,26.8 11.7,26.8 12.9,25.6 R_SDA.2 | R_SCL.2 10.35,26.7 10.25,26.8
N$1
  Top 0.406: R_VIN.2 89.67,65.36 RLED_VIN.A
N$2
  Top 0.406: U$10.2 89,37.25 88.5,36.75 85.7,36.75 R_VREG_ADJ.2
N$3
  Top 0.305: R_ADJ.2 A_GLED_5-10V.A
N$4
  Top 0.305: R_5V.2 16.93,9.18 A_BLED_5V.A
N$5  (via drill 0.6)
  Top 0.406: U$10.3 86.8,40.37 R_VREG.1 82.62,40.37 v80.75,38.5
  Bottom 0.406: v80.75,38.5 80.75,34.34 82.48,32.61 89.17,32.61 LM338T.3
N$6  (1 unrouted)
  Top 1.016: D_5V.12 D_5V.11 D_5V.10 D_5V.9 D_5V.8 D_5V.7 D_5V.6 D_5V.5 D_5V.4 D_5V.3 D_5V.2 D_5V.1
  Top 1.15: D_5V.12 35.88,74.35
N$8
  Top 1.016: 38.7,8.36 A_5V.8 A_5V.7 A_5V.6 A_5V.5 A_5V.4 A_5V.3 A_5V.2 A_5V.1
  Top 1.27: JP4.2 43.58,7.26 42.48,8.36 38.7,8.36
RXD  (1 unrouted)
  Top 0.305: R_ADJ2.1 34.5,56.25 35.25,55.5 37.5,55.5 39.07,53.93 PCB1.RX1 | R_ADJ2.2 34.54,59.31 36.12,59.31 37.5,60.69 37.5,63.75 39.14,65.39 U$11.RX 39.15,67.58 40.25,68.68 R_ADJ1.1
TXD
  Bottom 0.305: PCB1.TX1 41.61,57.86 U$11.TX
VIN
  Top 0.406: HV5.1 86.56,71.98 88.27,71.98 89.75,70.5 89.75,69.06 R_VIN.1
  Top 2.184: LM338T.1 94.27,32.48 97,29.75 97,14.29 94.32,11.61 91.4,11.61 5VREG.1
  Bottom 0.406: PCB1.VIN 71.97,36.72 83.08,47.83 J1.RED | 90.75,47.83 89.61,47.53
  Bottom 0.813: HV4.1 77.52,76.32 77.55,76.35
  Bottom 1.016: HV2.1 71.52,76.48 71.5,76.5
  Bottom 1.27: HV1.1 74.52,76.48 74.5,76.5 74.5,77.25 | HV2.1 71.52,77.23 | 71.52,77.23 71.5,77.25 | HV4.1 77.52,77.23 77.5,77.25 | HV3.1 80.52,77.23 80.5,77.25 | HV6.1 83.52,76.48 82.75,77.25 | HV5.1 86.52,77.23 86.5,77.25 | 71.52,77.23 73.73,77.23 73.75,77.25
  Bottom 2.184: 90.75,47.83 90.75,46.75 | LM338T.1 94.27,42.87 89.61,47.53
  Bottom 3.81: 72.8,77.3 72.85,77.25 73.75,77.25 74.5,77.25 77.5,77.25 80.5,77.25 82.75,77.25 86.5,77.25 87.5,77.25 96,69.25 96,51.5 92.33,47.83 90.75,47.83 J1.RED

### Text on the board
tTest: to do: / - separete variable voltage regulator between pins and between switches / - pinout to tap on variable power / - put capacitors on voltage regulators / - put heat sink on voltage regulator
tSilk: LOW VOLTAGE SWITCH | HIGH VOLTAGE SWITCH | + | + | + | + | + | + | – | + | – | D13 | D12 | D11 | D10 | D9 | D8 | D7 | D6 | D5 | D4 | D3 | D2 | – | D13 | 3v3 | D2 | D3 | D4 | D5 | D6 | D7 | D8 | D9 | D10 | D11 | D12 | + | Designed by John Lim | ADJ | 5V | A7 | LifePlanters | NC | A6 | PFC Breakout Board | A5 | 5V | V. 1.0 | A4 | A3 | A2 | A1 | A0 | A7 | A6 | A5 | A4 | A3 | A2 | A1 | A0 | GND | GND | VCC | SCL | SDA
_tsilk: ADJ | ADJ | 5v | VIN | 5V | 5v | ADJ